# EAGLE design main-board_v1_3 (EAGLE 7.6.0)
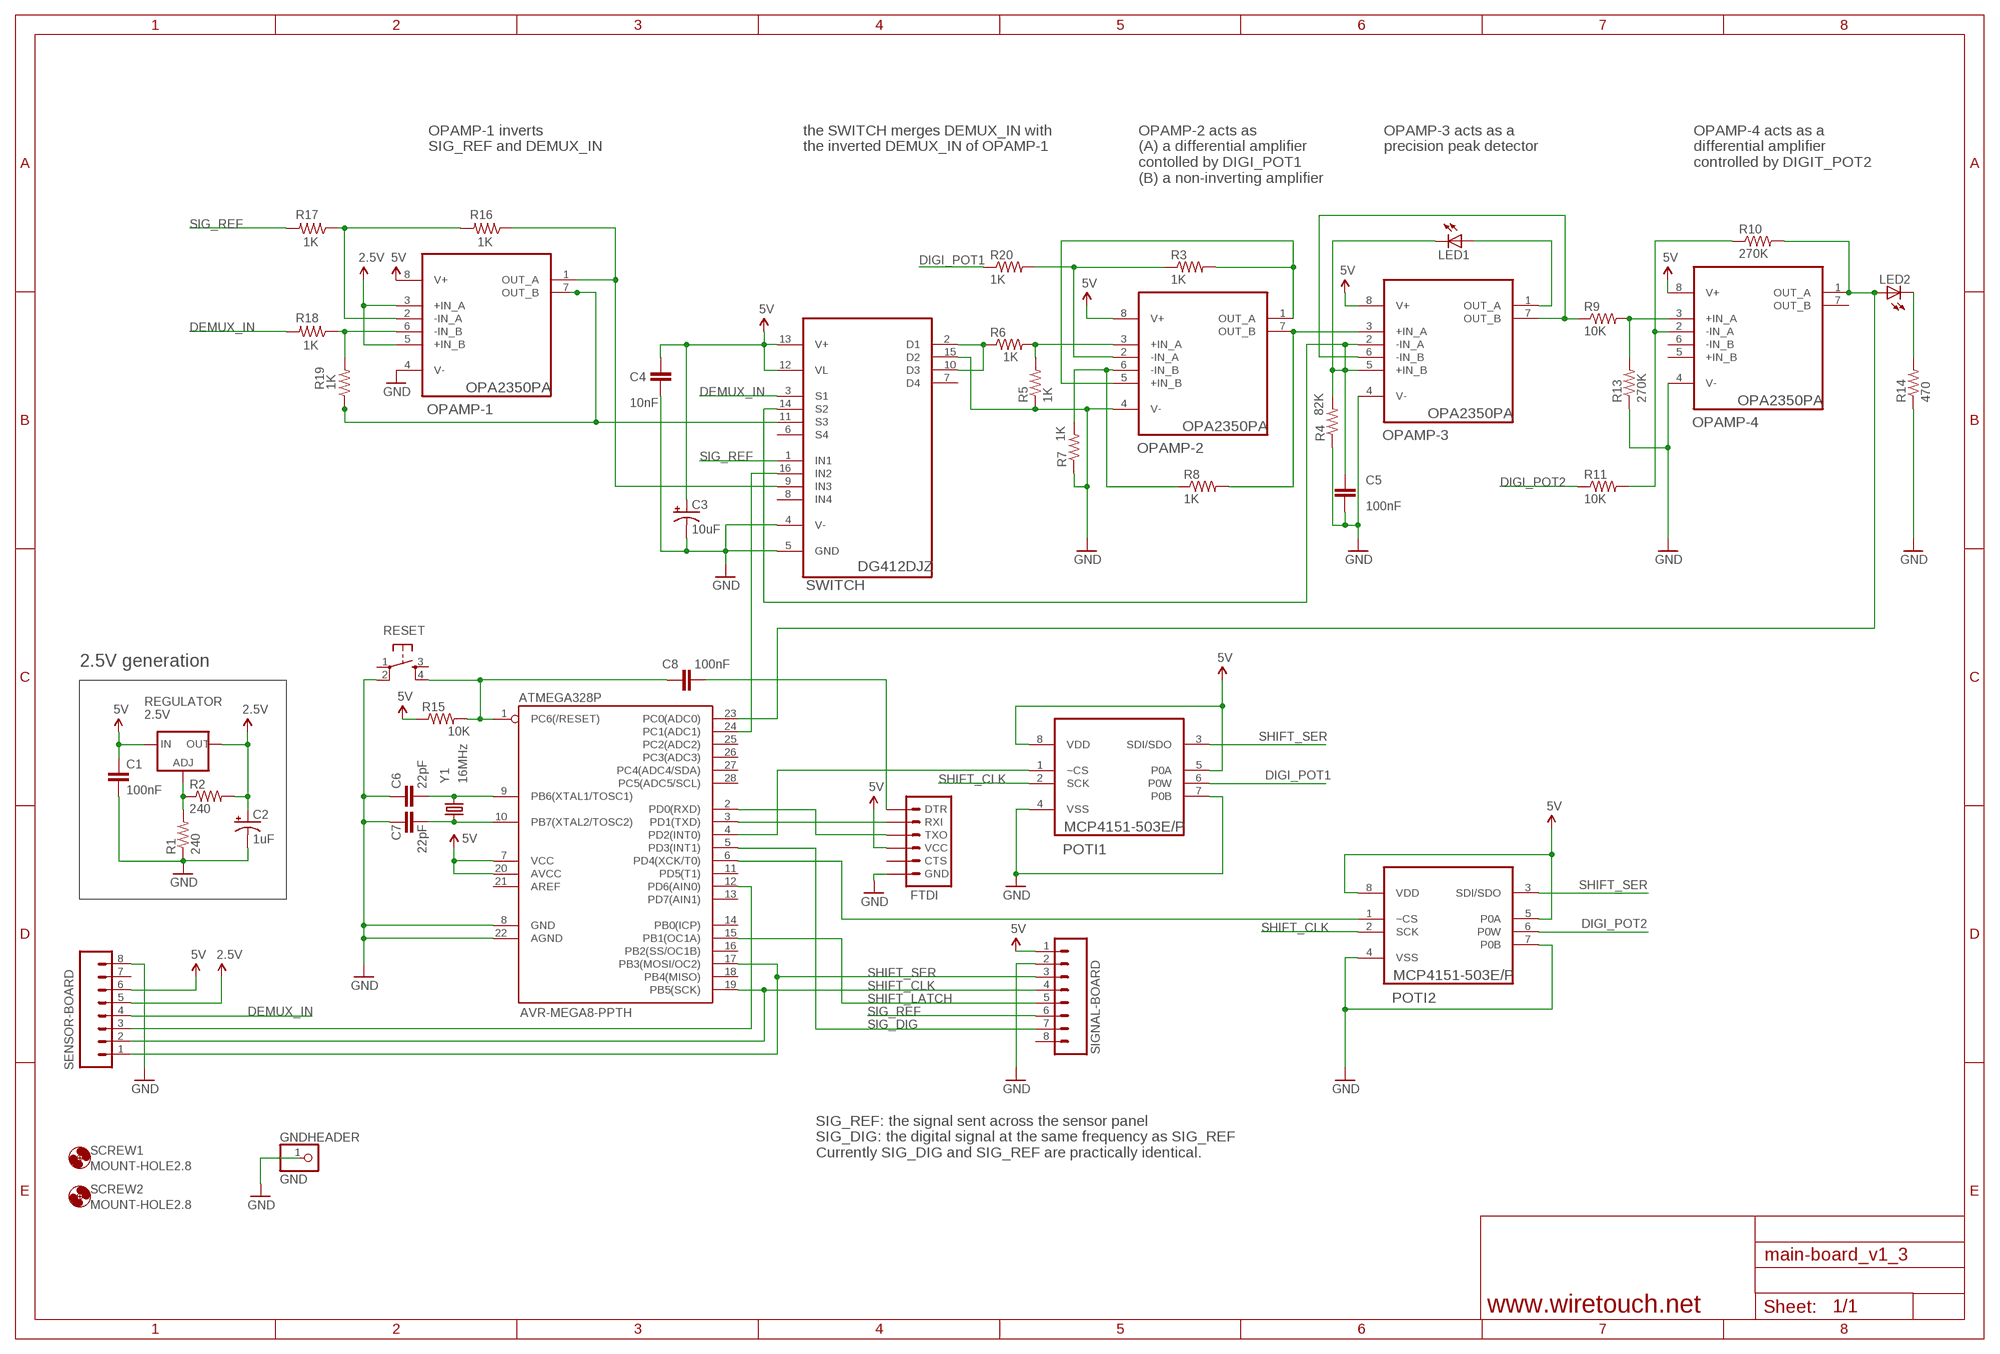
[diagram p0: schematic, sheet 1]

## Parts
ATMEGA328P  AVR-MEGA8-PPTH  [DIL28-3]
C1  100nF  CAPPTH  [CAP-PTH-SMALL]
C2  1uF  CAP_POLPTH2  [CPOL-RADIAL-10UF-25V]
C3  10uF  CAP_POLPTH2  [CPOL-RADIAL-10UF-25V]
C4  10nF  CAPPTH  [CAP-PTH-SMALL]
C5  100nF  CAPPTH  [CAP-PTH-SMALL]
C6  22pF  CAPPTH2  [CAP-PTH-SMALL2]
C7  22pF  CAPPTH2  [CAP-PTH-SMALL2]
C8  100nF  CAPPTH2  [CAP-PTH-SMALL2]
FTDI  ARDUINO_SERIAL_PROGRAMLONGPADS  [1X06_LONGPADS]
GNDHEADER  GND  PINHD-1X1  [1X01]
LED1  LED3MM  [LED3MM]
LED2  LED5MM  [LED5MM]
OPAMP-1  OPA2350PA  [DIP254P762X508-8]
OPAMP-2  OPA2350PA  [DIP254P762X508-8]
OPAMP-3  OPA2350PA  [DIP254P762X508-8]
OPAMP-4  OPA2350PA  [DIP254P762X508-8]
POTI1  MCP4151-503E/P  [DIP254P762X533-8]
POTI2  MCP4151-503E/P  [DIP254P762X533-8]
R1  240  RESISTORAXIAL-0.3  [AXIAL-0.3]
R2  240  RESISTORAXIAL-0.3  [AXIAL-0.3]
R3  1K  RESISTORAXIAL-0.3  [AXIAL-0.3]
R4  82K  RESISTORAXIAL-0.3  [AXIAL-0.3]
R5  1K  RESISTORAXIAL-0.3  [AXIAL-0.3]
R6  1K  RESISTORAXIAL-0.3  [AXIAL-0.3]
R7  1K  RESISTORAXIAL-0.3  [AXIAL-0.3]
R8  1K  RESISTORAXIAL-0.3  [AXIAL-0.3]
R9  10K  RESISTORAXIAL-0.3  [AXIAL-0.3]
R10  270K  RESISTORAXIAL-0.3  [AXIAL-0.3]
R11  10K  RESISTORAXIAL-0.3  [AXIAL-0.3]
R13  270K  RESISTORAXIAL-0.3  [AXIAL-0.3]
R14  470  RESISTORAXIAL-0.3  [AXIAL-0.3]
R15  10K  RESISTORAXIAL-0.3  [AXIAL-0.3]
R16  1K  RESISTORAXIAL-0.3  [AXIAL-0.3]
R17  1K  RESISTORAXIAL-0.3  [AXIAL-0.3]
R18  1K  RESISTORAXIAL-0.3  [AXIAL-0.3]
R19  1K  RESISTORAXIAL-0.3  [AXIAL-0.3]
R20  1K  RESISTORAXIAL-0.3  [AXIAL-0.3]
REGULATOR  2.5V  V_REG_317SINK  [TO220-ADJ]
RESET  Omron B3F momentary on switch  TAC_SWITCHPTH  [TACTILE-PTH]
SCREW1  MOUNT-HOLE2.8  [2,8]
SCREW2  MOUNT-HOLE2.8  [2,8]
SENSOR-BOARD  M08LONGPADS  [1X08_LONGPADS]
SIGNAL-BOARD  M08LONGPADS  [1X08_LONGPADS]
SWITCH  DG412DJZ  [DIP254P762X533-16]
Y1  16MHz  CRYSTALHC49US  [HC49US]

## Nets
2.8V: C2.1(+) OPAMP-1.3(+IN_A) OPAMP-1.5(+IN_B) R2.P$2 REGULATOR.OUT SENSOR-BOARD.5 ; supply symbol labelled 2.5V
5V: ATMEGA328P.7(VCC) ATMEGA328P.20(AVCC) C1.1 C3.1(+) C4.1 FTDI.4(VCC) OPAMP-1.8(V+) OPAMP-2.8(V+) OPAMP-3.8(V+) OPAMP-4.8(V+) POTI1.5(P0A) POTI1.8(VDD) POTI2.5(P0A) POTI2.8(VDD) R15.P$1 REGULATOR.IN SENSOR-BOARD.6 SIGNAL-BOARD.1 SWITCH.12(VL) SWITCH.13(V+)
DEMUX_IN: R18.P$2 SENSOR-BOARD.4 SWITCH.3(S1)
DIGI_POT1: POTI1.6(P0W) R20.P$1
DIGI_POT2: POTI2.6(P0W) R11.P$1
GND: ATMEGA328P.8(GND) ATMEGA328P.22(AGND) C1.2 C2.2(-) C3.2(-) C4.2 C5.2 C6.1 C7.1 FTDI.6(GND) GNDHEADER.1 OPAMP-1.4(V-) OPAMP-2.4(V-) OPAMP-3.4(V-) OPAMP-4.4(V-) POTI1.4(VSS) POTI1.7(P0B) POTI2.4(VSS) POTI2.7(P0B) R1.P$1 R4.P$1 R5.P$1 R7.P$1 R13.P$1 R14.P$1 RESET.2 SENSOR-BOARD.8 SIGNAL-BOARD.2 SWITCH.4(V-) SWITCH.5(GND) SWITCH.15(D2)
N$1: R6.P$1 SWITCH.2(D1) SWITCH.10(D3)
N$2: OPAMP-2.1(OUT_A) OPAMP-2.5(+IN_B) R3.P$2
N$3: R1.P$2 R2.P$1 REGULATOR.ADJ
N$4: OPAMP-2.2(-IN_A) R3.P$1 R20.P$2
N$5: OPAMP-2.3(+IN_A) R5.P$2 R6.P$2
N$6: OPAMP-2.6(-IN_B) R7.P$2 R8.P$1
N$7: OPAMP-4.2(-IN_A) R10.P$1 R11.P$2
N$8: ATMEGA328P.24(PC1(ADC1)) SWITCH.16(IN2)
N$9: LED1.A OPAMP-3.1(OUT_A)
N$10: OPAMP-2.7(OUT_B) OPAMP-3.3(+IN_A) R8.P$2
N$11: C5.1 LED1.K(C) OPAMP-3.2(-IN_A) OPAMP-3.5(+IN_B) R4.P$2 SWITCH.14(S2)
N$12: OPAMP-3.6(-IN_B) OPAMP-3.7(OUT_B) R9.P$1
N$13: OPAMP-4.3(+IN_A) R9.P$2 R13.P$2
N$14: ATMEGA328P.23(PC0(ADC0)) LED2.A OPAMP-4.1(OUT_A) R10.P$2
N$15: ATMEGA328P.6(PD4(XCK/T0)) POTI2.1(~CS)
N$16: OPAMP-1.6(-IN_B) R18.P$1 R19.P$2
N$17: LED2.K(C) R14.P$2
N$18: ATMEGA328P.9(PB6(XTAL1/TOSC1)) C6.2 Y1.2
N$19: ATMEGA328P.10(PB7(XTAL2/TOSC2)) C7.2 Y1.1
N$20: ATMEGA328P.1(PC6(/RESET)) C8.1 R15.P$2 RESET.4
N$21: ATMEGA328P.3(PD1(TXD)) FTDI.2(RXI)
N$22: ATMEGA328P.2(PD0(RXD)) FTDI.3(TXO)
N$23: C8.2 FTDI.1(DTR)
N$24: OPAMP-1.1(OUT_A) R16.P$1 SWITCH.9(IN3)
N$25: OPAMP-1.2(-IN_A) R16.P$2 R17.P$1
N$27: OPAMP-1.7(OUT_B) R19.P$1 SWITCH.11(S3)
N$28: ATMEGA328P.4(PD2(INT0)) POTI1.1(~CS)
N$127: ATMEGA328P.12(PD6(AIN0)) SENSOR-BOARD.3
SHIFT_CLK: ATMEGA328P.19(PB5(SCK)) POTI1.2(SCK) POTI2.2(SCK) SENSOR-BOARD.2 SIGNAL-BOARD.4
SHIFT_LATCH: ATMEGA328P.15(PB1(OC1A)) SIGNAL-BOARD.5
SHIFT_SER: ATMEGA328P.17(PB3(MOSI/OC2)) POTI1.3(SDI/SDO) POTI2.3(SDI/SDO) SENSOR-BOARD.1 SIGNAL-BOARD.3
SIG_DIG: ATMEGA328P.5(PD3(INT1)) SIGNAL-BOARD.7
SIG_REF: R17.P$2 SIGNAL-BOARD.6 SWITCH.1(IN1)
Unconnected: ATMEGA328P.11(PD5(T1)) ATMEGA328P.13(PD7(AIN1)) ATMEGA328P.14(PB0(ICP)) ATMEGA328P.16(PB2(SS/OC1B)) ATMEGA328P.18(PB4(MISO)) ATMEGA328P.21(AREF) ATMEGA328P.25(PC2(ADC2)) ATMEGA328P.26(PC3(ADC3)) ATMEGA328P.27(PC4(ADC4/SDA)) ATMEGA328P.28(PC5(ADC5/SCL)) FTDI.5(CTS) OPAMP-4.5(+IN_B) OPAMP-4.6(-IN_B) OPAMP-4.7(OUT_B) RESET.1 RESET.3 SENSOR-BOARD.7 SIGNAL-BOARD.8 SWITCH.6(S4) SWITCH.7(D4) SWITCH.8(IN4)

## Notes on the sheet
- OPAMP-1 inverts
  SIG_REF and DEMUX_IN
- the SWITCH merges DEMUX_IN with
  the inverted DEMUX_IN of OPAMP-1
- OPAMP-2 acts as
  (A) a differential amplifier
  contolled by DIGI_POT1
  (B) a non-inverting amplifier
- OPAMP-3 acts as a 
  precision peak detector
- OPAMP-4 acts as a
  differential amplifier
  controlled by DIGIT_POT2
- 2.5V generation
- SIG_REF: the signal sent across the sensor panel
  SIG_DIG: the digital signal at the same frequency as SIG_REF
  Currently SIG_DIG and SIG_REF are practically identical.
- www.wiretouch.net

## Library data of the parts
ATMEGA328P = SparkFun-DigitalIC:AVR-MEGA8-P: MICROCONTROLLER 8 Kbytes FLASH 1 kbytes SRAM 512 bytes EEPROM USART 4-channel 10 bit ADC 2-channel 8 bit ADC
C1 C4-C8 = SparkFun-Passives:CAP: Capacitor Standard 0603 ceramic capacitor, and 0.1" leaded capacitor.
C2 C3 = SparkFun-Passives:CAP_POL: Capacitor Polarized These are standard SMD and PTH capacitors. Normally 10uF, 47uF, and 100uF in electrolytic and tantalum varieties. Always verify the external diameter of the through hole cap, it varies with capacity, voltage, and manufacturer. The EIA devices should be standard.
FTDI = SparkFun-Connectors:ARDUINO_SERIAL_PROGRAM: FTDI connector footprints
GNDHEADER = pinhead:PINHD-1X1: PIN HEADER
LED1 LED2 = SparkFun-LED:LED: LEDs Standard schematic elements and footprints for 5mm, 3mm, 1206, and 0603 sized LEDs. 5mm - Spark Fun Electronics SKU : COM-00529 (and others)
OPAMP-1-OPAMP-4 = gkaindl:OPA2350PA: OPERATIONAL AMPLIFIER; MPN: OPA2350PA; OC_FARNELL: 4353316; OC_NEWARK: 75C4730; PACKAGE: PDIP; SUPPLIER: Texas Instruments
POTI1 POTI2 = gkaindl:MCP4151-503E/P: Digital POT; MPN: MCP4151-503E/P; OC_FARNELL: 1840819; OC_NEWARK: 77M2694; PACKAGE: DIP-8; SUPPLIER: Microchip
R1-R11 R13-R20 = SparkFun-Passives:RESISTOR: Resistor Basic schematic elements and footprints for 0603, 1206, and PTH resistors.
REGULATOR = SparkFun-PowerIC:V_REG_317: Voltage Regulator Standard LM317 adjustable voltage regulator. AOI (Adjust Output Input). Google 'LM317 Calculator' for easy to use app to get the two resistor values needed. 240/720 for 5V output. 240/390 for 3.3V output. Spark Fun Electronics SKU : COM-00527
RESET = SparkFun-Electromechanical:TAC_SWITCH: Momentary Switch Button commonly used for reset or general input. Spark Fun Electronics SKU : COM-00097 SMT- SWCH-08247
SCREW1 SCREW2 = holes:MOUNT-HOLE: MOUNTING HOLE with drill center marker
SENSOR-BOARD SIGNAL-BOARD = SparkFun-Connectors:M08: Header 8 Standard 8-pin 0.1" header. Use with straight break away headers (SKU : PRT-00116), right angle break away headers (PRT-00553), swiss pins (PRT-00743), machine pins (PRT-00117), and female headers (PRT-00115).
SWITCH = gkaindl:DG412DJZ: CMOS Analog switches; MPN: DG412DJZ; OC_FARNELL: 1561997; OC_NEWARK: 79K6183; PACKAGE: PDIP-16; SUPPLIER: INTERSIL
Y1 = SparkFun-FreqCtrl:CRYSTAL: Various standard crystals. Proven footprints. Spark Fun Electronics SKU : COM-00534

## Board
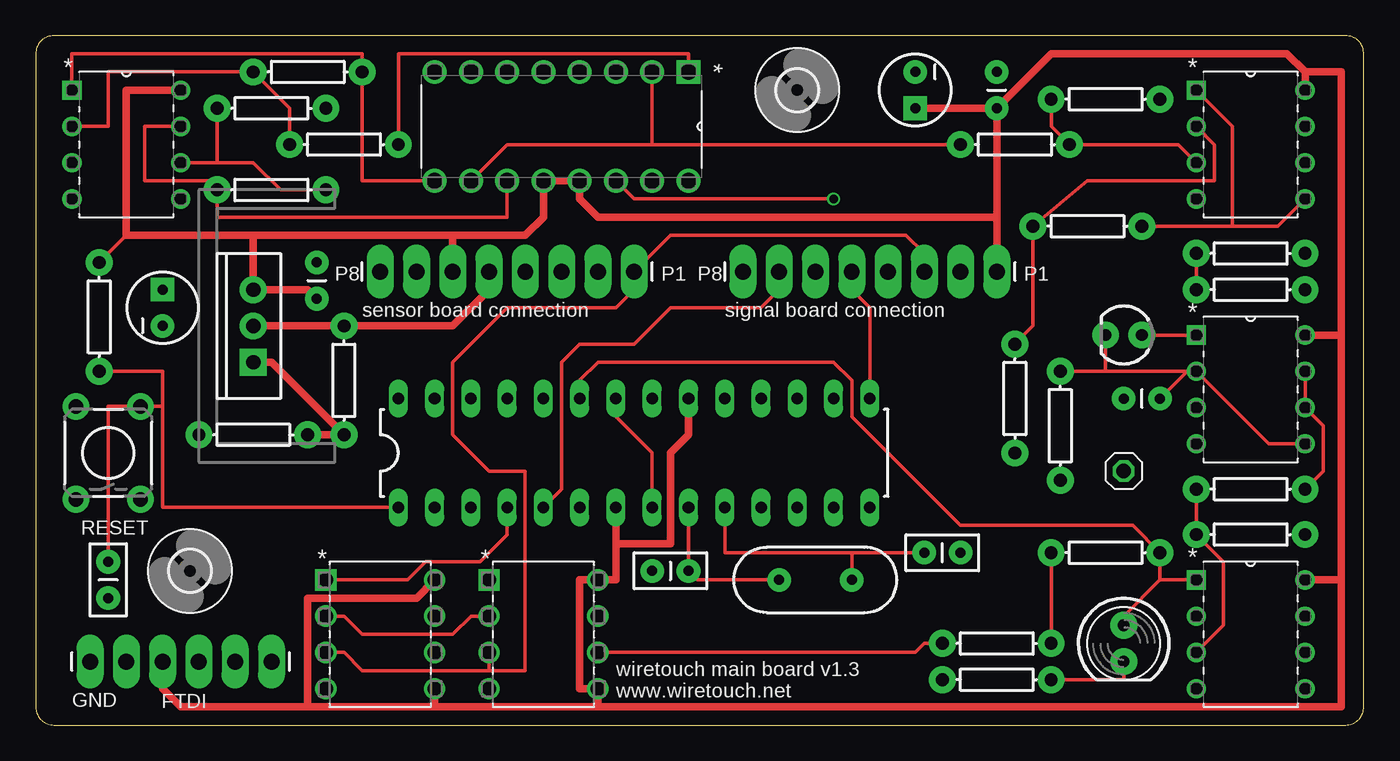
[diagram p1: board, top side]
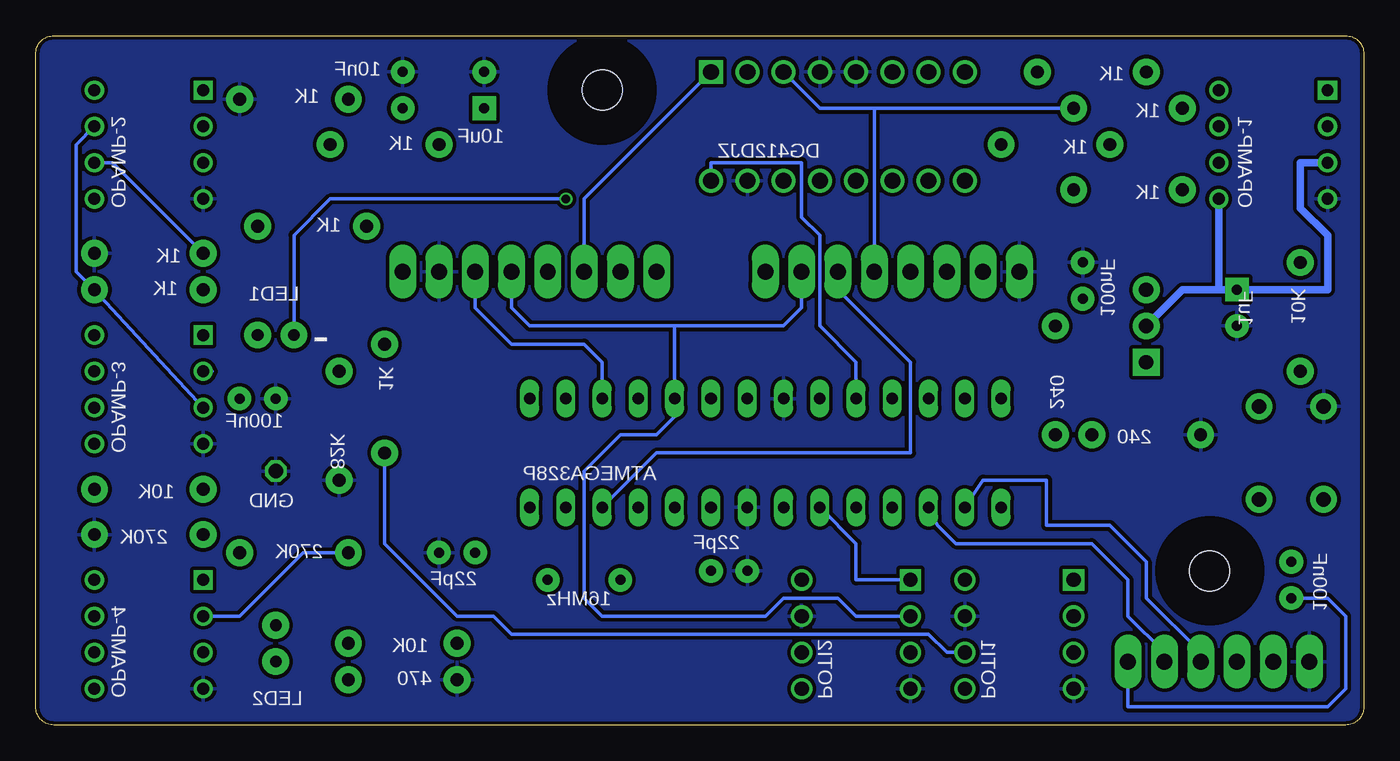
[diagram p2: board, bottom side, seen from below]

Size 93.02 x 48.26 mm. Coordinates in mm from the lower left corner, seen from the top.
Outline: 0,46.99 0,1.27 arc90 1.27,0 91.75,0 arc90 93.02,1.27 93.02,46.99 arc90 91.75,48.26 1.27,48.26 arc90 0,46.99
Copper layers (1*16): Top 0.035mm / dielectric 1.5mm / Bottom 0.035mm
Design rules "Fusion_eagle_rule_v1.1": minimum track width 6mil, minimum drill 12mil, track to track 6mil, track to pad 6mil, pad to pad 6mil, via to via 6mil, smd to smd 0mil, copper to edge 10mil, drill to drill 10mil, minimum pad ring 10mil, minimum via ring 6mil, stop-mask expansion 2mil, vias tented up to drill 100mil, thermal gap 10mil

### Footprints (pad centres in the part's own frame; a part is rotated, then mirrored left to right if it is on the bottom)
DIL28-3 = drill 0.813 long: 1 -16.51,-3.81; 2 -13.97,-3.81; 3 -11.43,-3.81; 4 -8.89,-3.81; 5 -6.35,-3.81; 6 -3.81,-3.81; 7 -1.27,-3.81; 8 1.27,-3.81; 9 3.81,-3.81; 10 6.35,-3.81; 11 8.89,-3.81; 12 11.43,-3.81; 13 13.97,-3.81; 14 16.51,-3.81; 15 16.51,3.81; 16 13.97,3.81; 17 11.43,3.81; 18 8.89,3.81; 19 6.35,3.81; 20 3.81,3.81; 21 1.27,3.81; 22 -1.27,3.81; 23 -3.81,3.81; 24 -6.35,3.81; 25 -8.89,3.81; 26 -11.43,3.81; 27 -13.97,3.81; 28 -16.51,3.81
CAP-PTH-SMALL = drill 0.7 pad 1.651: 1 0,0; 2 2.54,0
CPOL-RADIAL-10UF-25V = drill 0.7 pad 1.651 square: 1 1.27,0 | drill 0.7 pad 1.651: 2 -1.27,0
CAP-PTH-SMALL2 = drill 0.7 pad 1.651: 1 0,0; 2 2.54,0
1X06_LONGPADS = drill 1.118 pad 1.88 long: 1 0,0; 2 2.54,0; 3 5.08,0; 4 7.62,0; 5 10.16,0; 6 12.7,0
1X01 = drill 1.016 octagon: 1 0,0
LED3MM = drill 0.813 pad 1.88: A -1.27,0; K 1.27,0
LED5MM = drill 0.813 pad 1.88: A -1.27,0; K 1.27,0
DIP254P762X508-8 = drill 0.838 square: 1 -7.62,7.62 | drill 0.838: 2 -7.62,5.08; 3 -7.62,2.54; 4 -7.62,0; 5 0,0; 6 0,2.54; 7 0,5.08; 8 0,7.62
DIP254P762X533-8 = drill 0.991 square: 1 -7.62,7.62 | drill 0.991: 2 -7.62,5.08; 3 -7.62,2.54; 4 -7.62,0; 5 0,0; 6 0,2.54; 7 0,5.08; 8 0,7.62
AXIAL-0.3 = drill 0.9 pad 1.88: P$1 -3.81,0; P$2 3.81,0
TO220-ADJ = drill 1 pad 1.88 square: ADJ -2.54,0 | drill 1 pad 1.88: IN 2.54,0; OUT 0,0
TACTILE-PTH = drill 1.016 pad 1.88: 1 -3.251,2.261; 2 3.251,2.261; 3 -3.251,-2.261; 4 3.251,-2.261
2,8 = hole 2.8: 0,0
1X08_LONGPADS = drill 1.118 pad 1.88 long: 1 0,0; 2 2.54,0; 3 5.08,0; 4 7.62,0; 5 10.16,0; 6 12.7,0; 7 15.24,0; 8 17.78,0
DIP254P762X533-16 = drill 1.118 square: 1 -7.62,17.78 | drill 1.118: 2 -7.62,15.24; 3 -7.62,12.7; 4 -7.62,10.16; 5 -7.62,7.62; 6 -7.62,5.08; 7 -7.62,2.54; 8 -7.62,0; 9 0,0; 10 0,2.54; 11 0,5.08; 12 0,7.62; 13 0,10.16; 14 0,12.7; 15 0,15.24; 16 0,17.78
HC49US = drill 0.7 pad 1.651: 1 -2.54,0; 2 2.54,0

### Placement (x,y rotation side)
ATMEGA328P  41.91,19.05 0 top
C1  19.68,29.84 90 top
C2  8.89,29.21 90 top
C3  61.59,44.45 270 top
C4  67.31,43.18 90 top
C5  78.74,22.86 180 top
C6  43.18,10.79 0 top
C7  64.77,12.06 180 top
C8  5.08,11.43 270 top
FTDI  16.51,4.45 180 top
GNDHEADER  76.2,17.78 0 top
LED1  76.2,27.3 180 top
LED2  76.2,5.71 270 top
OPAMP-1  10.16,36.83 0 top
OPAMP-2  88.9,36.83 0 top
OPAMP-3  88.9,19.68 0 top
OPAMP-4  88.9,2.54 0 top
POTI1  27.94,2.54 0 top
POTI2  39.37,2.54 0 top
R1  15.24,20.32 0 top
R2  21.59,24.13 90 top
R3  73.66,34.92 0 top
R4  71.75,20.95 90 top
R5  74.93,43.81 180 top
R6  68.58,40.64 0 top
R7  85.09,33.02 180 top
R8  85.09,30.48 0 top
R9  85.09,16.51 180 top
R10  74.93,12.06 0 top
R11  67.31,5.71 0 top
R13  85.09,13.34 180 top
R14  67.31,3.17 0 top
R15  4.45,28.57 270 top
R16  19.05,45.72 180 top
R17  21.59,40.64 0 top
R18  16.51,43.18 0 top
R19  16.51,37.47 0 top
R20  68.58,22.86 90 top
REGULATOR  15.24,27.94 90 top
RESET  5.08,19.05 90 top
SCREW1  10.79,10.79 0 top
SCREW2  53.34,44.45 0 top
SENSOR-BOARD  41.91,31.75 180 top
SIGNAL-BOARD  67.31,31.75 180 top
SWITCH  27.94,38.1 270 top
Y1  54.61,10.16 180 top

### Tracks (layer width: path | path; a pad name or v marks a point on that pad's centre or on a via)
2.8V
  Top 0.508: REGULATOR.OUT R2.P$2 29.21,27.94 31.75,30.48 SENSOR-BOARD.5
  Bottom 0.508: OPAMP-1.3 4.45,39.37 4.45,36.2 2.54,34.29 2.54,30.48 C2.1 10.16,30.48 | OPAMP-1.5 10.16,30.48 | REGULATOR.OUT 12.7,30.48 10.16,30.48
5V
  Top 0.254: R15.P$1 6.35,34.29
  Top 0.508: 91.44,27.3 91.44,45.72 88.9,45.72 | 91.44,27.3 OPAMP-3.8 | OPAMP-4.8 91.44,10.16 | 91.44,10.16 91.44,27.3 | FTDI.4 8.89,2.54 10.16,1.27 19.05,1.27 | 19.05,1.27 27.94,1.27 | POTI1.5 27.94,1.27 | 27.94,1.27 39.37,1.27 | SENSOR-BOARD.6 29.21,34.29 | 29.21,34.29 34.29,34.29 35.56,35.56 SWITCH.12 SWITCH.13 38.1,36.83 39.37,35.56 67.31,35.56 | 15.24,34.29 REGULATOR.IN 19.05,30.48 C1.1 | 15.24,34.29 29.21,34.29 | OPAMP-1.8 6.35,44.45 6.35,34.29 15.24,34.29 | SIGNAL-BOARD.1 67.31,35.56 | POTI1.8 26.67,8.89 19.05,8.89 19.05,1.27 | ATMEGA328P.7 40.64,12.7 | 40.64,12.7 40.64,10.16 POTI2.8 38.1,10.16 38.1,2.54 POTI2.5 39.37,1.27 | 39.37,1.27 91.44,1.27 91.44,10.16 | ATMEGA328P.20 45.72,20.32 44.45,19.05 44.45,12.7 40.64,12.7 | OPAMP-2.8 88.9,45.72 | 67.31,35.56 C4.1 | C4.1 71.12,46.99 87.63,46.99 88.9,45.72 | C3.1 C4.1
DEMUX_IN
  Bottom 0.254: SENSOR-BOARD.4 34.29,43.18 | SWITCH.3 38.1,43.18 34.29,43.18 | 34.29,43.18 R18.P$2
DIGI_POT1
  Bottom 0.254: POTI1.6 29.21,5.08 30.48,6.35 59.69,6.35 60.96,7.62 63.5,7.62 68.58,12.7 R20.P$1
DIGI_POT2
  Top 0.254: POTI2.6 61.59,5.08 62.23,5.71 R11.P$1
GND
  Top 0.254: ATMEGA328P.22 40.64,21.59 43.18,19.05 ATMEGA328P.8
  pour Bottom (isolate 0.254): 0,48.26 0,0 93.34,0 93.34,48.26
N$1
  Top 0.254: SWITCH.10 33.02,40.64 43.18,40.64 | SWITCH.2 43.18,40.64 | 43.18,40.64 R6.P$1
N$2
  Top 0.254: OPAMP-2.1 83.82,41.91 83.82,34.92 | 83.82,34.92 87,34.92 OPAMP-2.5 | R3.P$2 83.82,34.92
N$3
  Top 0.508: REGULATOR.ADJ 16.51,25.4 R2.P$1 R1.P$2
N$4
  Top 0.254: R20.P$2 69.85,27.94 R3.P$1 73.66,38.1 82.55,38.1 82.55,40.64 OPAMP-2.2
N$5
  Top 0.254: R5.P$2 71.12,41.91 R6.P$2 80.01,40.64 OPAMP-2.3
N$6
  Top 0.254: R8.P$1 R7.P$2
  Bottom 0.254: OPAMP-2.6 87.63,39.37 R7.P$2
N$7
  Top 0.254: R11.P$2 R10.P$1
  Bottom 0.254: OPAMP-4.2 78.74,7.62 74.3,12.06 R10.P$1
N$8
  Bottom 0.254: SWITCH.16 45.72,39.37 39.37,39.37 39.37,35.56 38.1,34.29 38.1,27.94 35.56,25.4 ATMEGA328P.24
N$9
  Top 0.254: LED1.A OPAMP-3.1
N$10
  Bottom 0.254: OPAMP-2.7 90.17,40.64 90.17,31.75 R8.P$2 OPAMP-3.3
N$11  (via drill 0.6)
  Top 0.254: LED1.K 74.93,24.77 | 74.93,24.77 R4.P$2 | OPAMP-3.5 86.36,19.68 OPAMP-3.2 80.64,24.77 | 80.64,24.77 74.93,24.77 | SWITCH.14 41.91,36.83 v55.88,36.83 | C5.1 80.64,24.77
  Bottom 0.254: 80.64,24.77 OPAMP-3.2 | v55.88,36.83 72.39,36.83 74.93,34.29 LED1.K
N$12
  Top 0.254: OPAMP-3.7 OPAMP-3.6 90.17,20.95 90.17,17.78 R9.P$1
N$13
  Top 0.254: R9.P$2 R13.P$2 83.19,11.43 83.19,6.99 OPAMP-4.3
N$14
  Top 0.254: OPAMP-4.1 78.74,10.16 | 78.74,10.16 R10.P$2 76.83,13.97 64.77,13.97 57.15,21.59 57.15,24.13 55.88,25.4 39.37,25.4 38.1,24.13 ATMEGA328P.23 | 78.74,10.16 76.2,7.62 LED2.A
N$15
  Bottom 0.254: POTI2.1 35.56,10.16 35.56,12.7 ATMEGA328P.6
N$16
  Top 0.254: OPAMP-1.6 12.7,39.37 | R18.P$1 12.7,39.37 | 12.7,39.37 15.24,39.37 17.14,37.47 R19.P$2
N$17
  Top 0.254: LED2.K 76.2,3.17 R14.P$2
N$18
  Top 0.254: ATMEGA328P.9 C6.2 46.35,10.16 Y1.2
N$19
  Top 0.254: Y1.1 57.15,12.06 | 57.15,12.06 48.26,12.06 ATMEGA328P.10 | 57.15,12.06 C7.2
N$20
  Top 0.254: R15.P$2 8.89,24.77 8.89,22.23 | C8.1 5.08,22.3 RESET.4 8.81,22.3 8.89,22.23 | ATMEGA328P.1 8.89,15.24 8.89,22.23
N$21
  Bottom 0.254: ATMEGA328P.3 29.84,13.97 28.57,12.7 19.05,12.7 16.51,10.16 16.51,7.62 13.97,5.08 FTDI.2
N$22
  Bottom 0.254: ATMEGA328P.2 26.67,17.14 22.23,17.14 22.23,13.97 17.78,13.97 15.24,11.43 15.24,8.89 11.43,5.08 FTDI.3
N$23
  Bottom 0.254: FTDI.1 16.51,1.27 2.54,1.27 1.27,2.54 1.27,7.62 2.54,8.89 C8.2
N$24
  Top 0.254: SWITCH.9 22.86,38.1 R16.P$1 22.86,46.99 2.54,46.99 OPAMP-1.1
N$25
  Top 0.254: OPAMP-1.2 5.08,41.91 5.08,45.72 R16.P$2 17.78,43.18 R17.P$1
N$27
  Top 0.254: SWITCH.11 33.02,35.56 12.7,35.56 R19.P$1 12.06,38.1 7.62,38.1 7.62,41.91 OPAMP-1.7
N$28
  Top 0.254: ATMEGA328P.4 33.02,13.34 31.11,11.43 27.3,11.43 26.04,10.16 POTI1.1
N$127
  Bottom 0.254: ATMEGA328P.12 49.53,19.05 31.75,19.05 31.75,25.4 36.83,30.48 SENSOR-BOARD.3
SHIFT_CLK
  Top 0.254: POTI2.2 30.48,7.62 29.21,6.35 22.86,6.35 21.59,7.62 POTI1.2
  Bottom 0.254: SENSOR-BOARD.2 39.37,29.21 40.64,27.94 48.26,27.94 | SIGNAL-BOARD.4 59.69,29.21 58.42,27.94 48.26,27.94 | POTI2.2 35.56,7.62 36.83,8.89 40.64,8.89 41.91,7.62 53.34,7.62 54.61,8.89 54.61,17.78 52.07,20.32 49.53,20.32 48.26,21.59 ATMEGA328P.19 48.26,27.94
SHIFT_LATCH
  Top 0.254: SIGNAL-BOARD.5 57.15,30.48 58.42,29.21 ATMEGA328P.15
SHIFT_SER
  Top 0.254: 31.75,3.81 22.86,3.81 21.59,5.08 POTI1.3 | 31.75,3.81 34.29,3.81 34.29,17.78 31.75,17.78 29.21,20.32 29.21,25.4 33.02,29.21 40.64,29.21 41.91,30.48 SENSOR-BOARD.1 44.45,34.29 60.96,34.29 62.23,33.02 SIGNAL-BOARD.3 | 31.75,3.81 POTI2.3
  Bottom 0.254: SIGNAL-BOARD.3 62.23,29.21 59.69,26.67 54.61,26.67 53.34,25.4 ATMEGA328P.17
SIG_DIG
  Top 0.254: SIGNAL-BOARD.7 52.07,30.48 50.8,29.21 44.45,29.21 41.91,26.67 38.1,26.67 36.83,25.4 36.83,16.51 ATMEGA328P.5
SIG_REF
  Top 0.254: SWITCH.1 45.72,46.99 25.4,46.99 R17.P$2
  Bottom 0.254: SWITCH.1 54.61,36.83 SIGNAL-BOARD.6

### Text on the board
tPlace: P8 | P1 | P8 | P1 | sensor board connection | signal board connection | wiretouch main board v1.3 / www.wiretouch.net | GND
bPlace: - | GND